# Altium schematic sheet DAQ.SchDoc
size A3
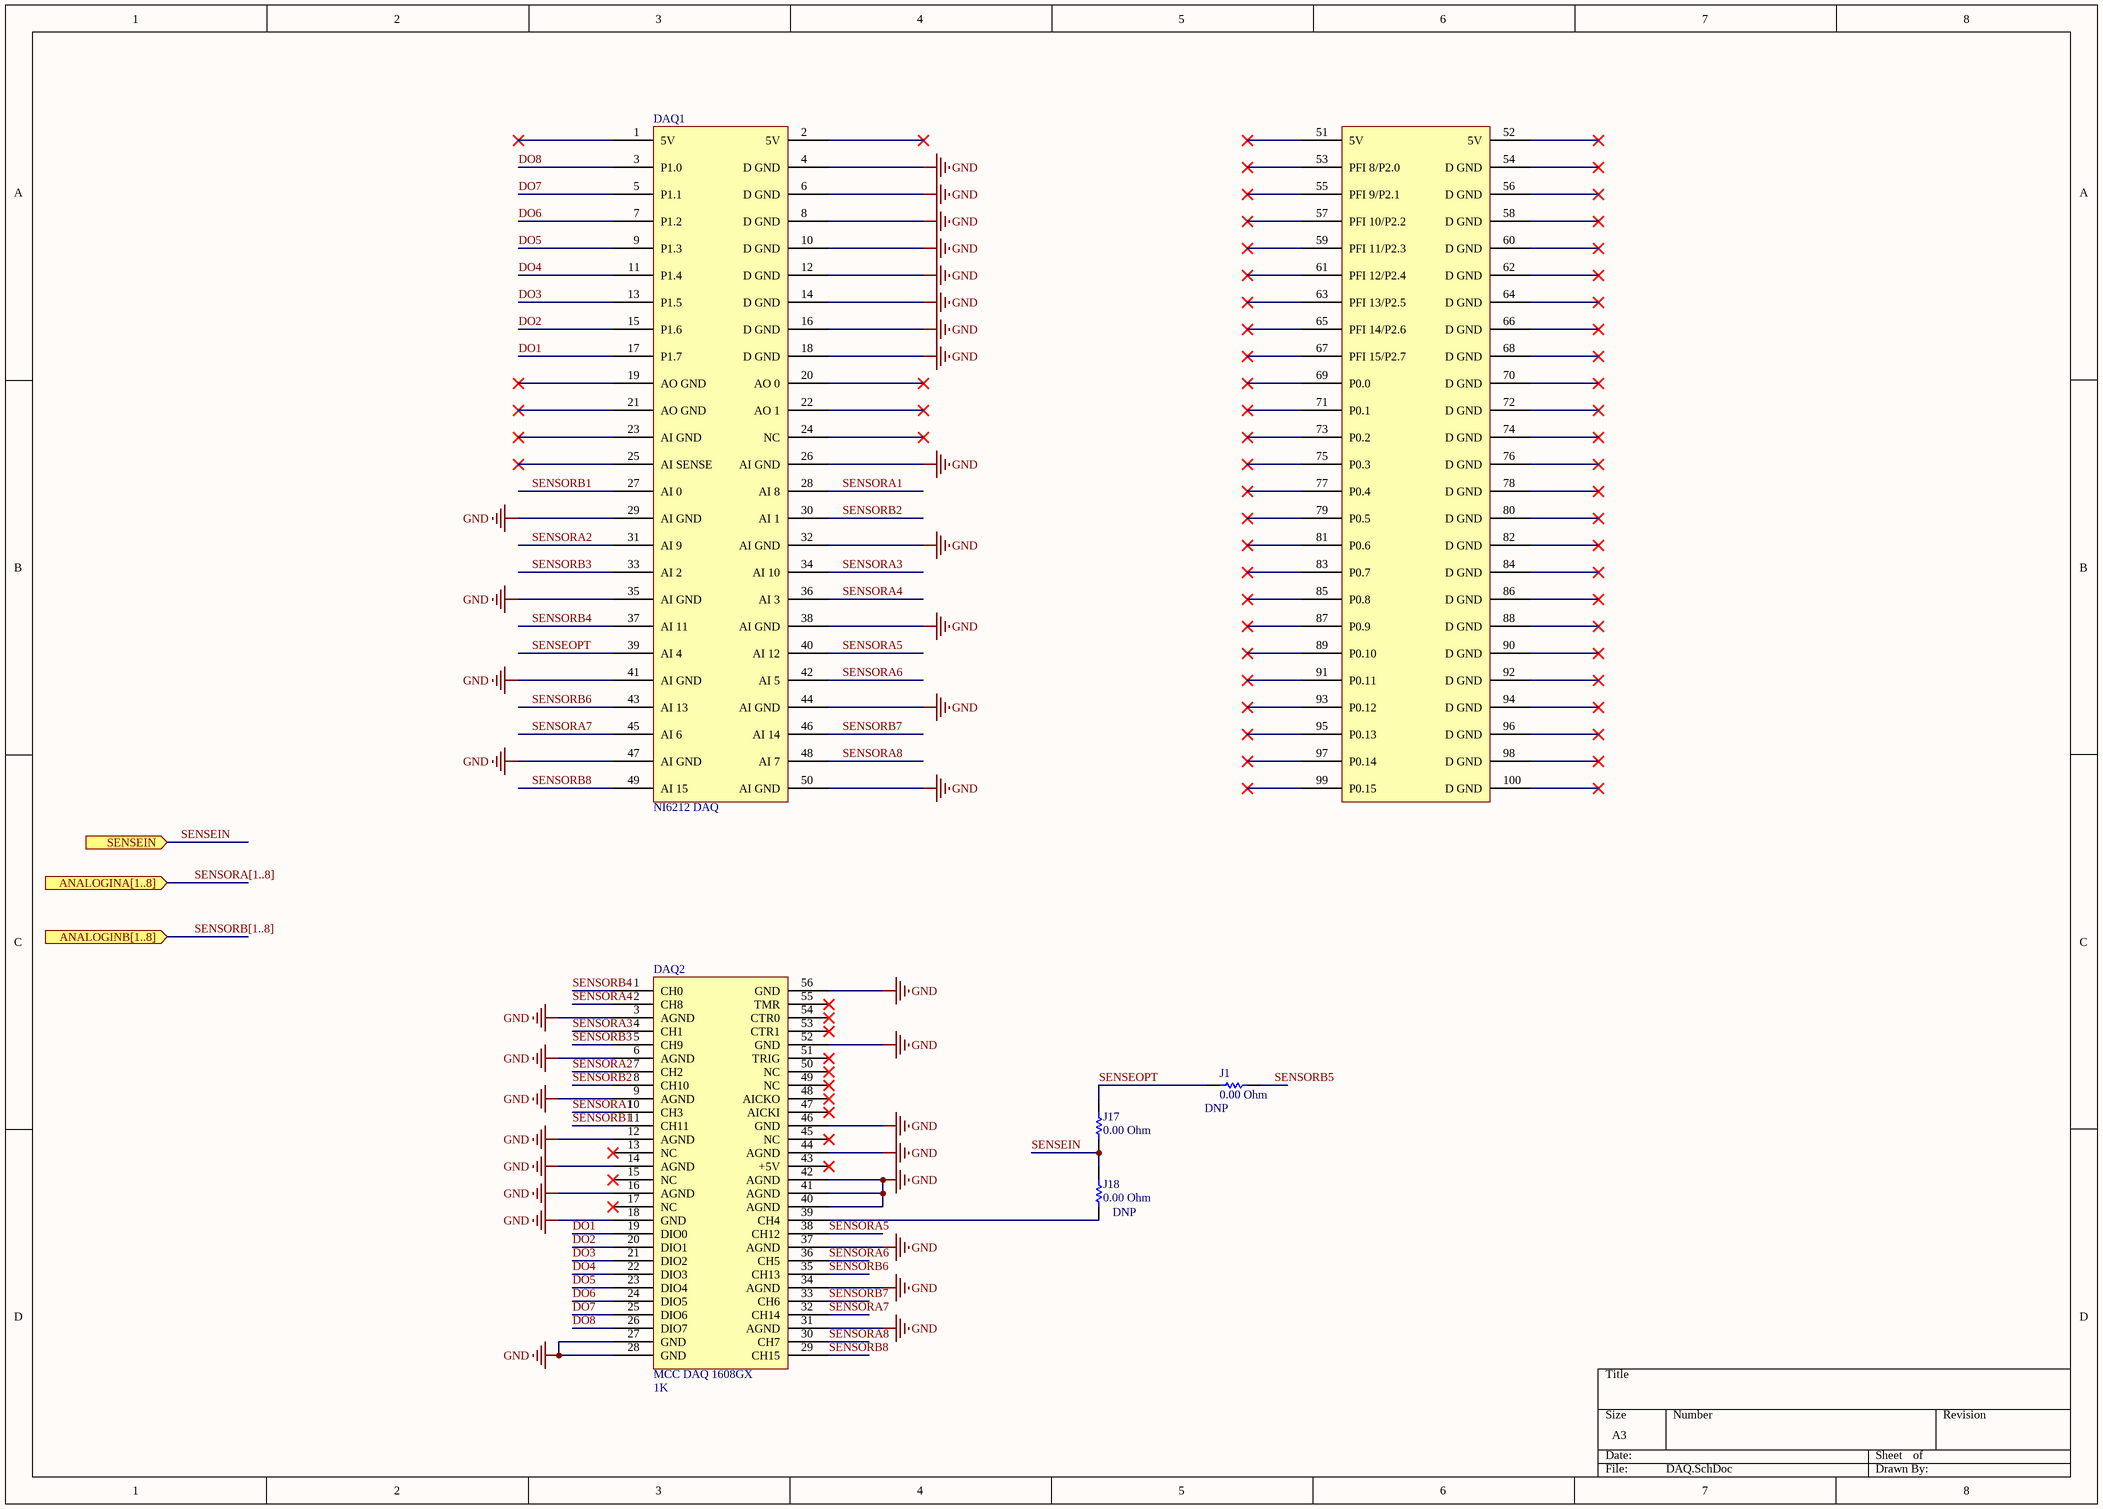
[diagram p0: DAQ.SchDoc]

## Parts
DAQ1  NI6212 DAQ  [NIDAQ6212]
DAQ2  MCC DAQ 1608GX  value 1K  [DAQ_MCC]
J1  0.00 Ohm  OPTION: DNP  [RESC1206(3216)_M]
J17  0.00 Ohm  [RESC1206(3216)_M]
J18  0.00 Ohm  OPTION: DNP  [RESC1206(3216)_M]

## Ports
ANALOGINA[1..8] (in), ANALOGINB[1..8] (in), SENSEIN (in)

## Nets
GND: DAQ1.4(D_GND) DAQ1.6(D_GND) DAQ1.8(D_GND) DAQ1.10(D_GND) DAQ1.12(D_GND) DAQ1.14(D_GND) DAQ1.16(D_GND) DAQ1.18(D_GND) DAQ1.26(AI_GND) DAQ1.29(AI_GND) DAQ1.32(AI_GND) DAQ1.35(AI_GND) DAQ1.38(AI_GND) DAQ1.41(AI_GND) DAQ1.44(AI_GND) DAQ1.47(AI_GND) DAQ1.50(AI_GND) DAQ2.3(AGND) DAQ2.6(AGND) DAQ2.9(AGND) DAQ2.12(AGND) DAQ2.14(AGND) DAQ2.16(AGND) DAQ2.18(GND) DAQ2.27(GND) DAQ2.28(GND) DAQ2.31(AGND) DAQ2.34(AGND) DAQ2.37(AGND) DAQ2.40(AGND) DAQ2.41(AGND) DAQ2.42(AGND) DAQ2.44(AGND) DAQ2.46(GND) DAQ2.52(GND) DAQ2.56(GND)
DO1: DAQ1.17(P1.7) DAQ2.19(DIO0)
DO2: DAQ1.15(P1.6) DAQ2.20(DIO1)
DO3: DAQ1.13(P1.5) DAQ2.21(DIO2)
DO4: DAQ1.11(P1.4) DAQ2.22(DIO3)
DO5: DAQ1.9(P1.3) DAQ2.23(DIO4)
DO6: DAQ1.7(P1.2) DAQ2.24(DIO5)
DO7: DAQ1.5(P1.1) DAQ2.25(DIO6)
DO8: DAQ1.3(P1.0) DAQ2.26(DIO7)
SENSEIN: J17.1 J18.2 ; port SENSEIN
SENSEOPT: DAQ1.39(AI_4) J1.2 J17.2
SENSORA1: DAQ1.28(AI_8) DAQ2.10(CH3)
SENSORA2: DAQ1.31(AI_9) DAQ2.7(CH2)
SENSORA3: DAQ1.34(AI_10) DAQ2.4(CH1)
SENSORA4: DAQ1.36(AI_3) DAQ2.2(CH8)
SENSORA5: DAQ1.40(AI_12) DAQ2.38(CH12)
SENSORA6: DAQ1.42(AI_5) DAQ2.36(CH5)
SENSORA7: DAQ1.45(AI_6) DAQ2.32(CH14)
SENSORA8: DAQ1.48(AI_7) DAQ2.30(CH7)
SENSORB1: DAQ1.27(AI_0) DAQ2.11(CH11)
SENSORB2: DAQ1.30(AI_1) DAQ2.8(CH10)
SENSORB3: DAQ1.33(AI_2) DAQ2.5(CH9)
SENSORB4: DAQ1.37(AI_11) DAQ2.1(CH0)
SENSORB5: J1.1
SENSORB6: DAQ1.43(AI_13) DAQ2.35(CH13)
SENSORB7: DAQ1.46(AI_14) DAQ2.33(CH6)
SENSORB8: DAQ1.49(AI_15) DAQ2.29(CH15)
NetDAQ2_39: DAQ2.39(CH4) J18.1

Not connected (* = marked no-connect by the designer): DAQ1 1(5V)* 2(5V)* 19(AO_GND)* 20(AO_0)* 21(AO_GND)* 22(AO_1)* 23(AI_GND)* 24(NC)* 25(AI_SENSE)* 51(5V)* 52(5V)* 53(PFI_8/P2.0)* 54(D_GND)* 55(PFI_9/P2.1)* 56(D_GND)* 57(PFI_10/P2.2)* 58(D_GND)* 59(PFI_11/P2.3)* 60(D_GND)* 61(PFI_12/P2.4)* 62(D_GND)* 63(PFI_13/P2.5)* 64(D_GND)* 65(PFI_14/P2.6)* 66(D_GND)* 67(PFI_15/P2.7)* 68(D_GND)* 69(P0.0)* 70(D_GND)* 71(P0.1)* 72(D_GND)* 73(P0.2)* 74(D_GND)* 75(P0.3)* 76(D_GND)* 77(P0.4)* 78(D_GND)* 79(P0.5)* 80(D_GND)* 81(P0.6)* 82(D_GND)* 83(P0.7)* 84(D_GND)* 85(P0.8)* 86(D_GND)* 87(P0.9)* 88(D_GND)* 89(P0.10)* 90(D_GND)* 91(P0.11)* 92(D_GND)* 93(P0.12)* 94(D_GND)* 95(P0.13)* 96(D_GND)* 97(P0.14)* 98(D_GND)* 99(P0.15)* 100(D_GND)*; DAQ2 13(NC)* 15(NC)* 17(NC)* 43(+5V)* 45(NC)* 47(AICKI)* 48(AICKO)* 49(NC)* 50(NC)* 51(TRIG)* 53(CTR1)* 54(CTR0)* 55(TMR)*

## Buses and harness runs
bus SENSORA[1..8] = port ANALOGINA[1..8]
bus SENSORB[1..8] = port ANALOGINB[1..8]

## Library data of the parts
DAQ1 = NI6212: DAQ Unit; Published: 8-Jun-2000; Publisher: National Instruments
DAQ2 = MCC USB-1608GX_OEM: Published: 8-Jun-2000; LatestRevisionDate: 29-May-2009; LatestRevisionNote: IPC-7351 Footprint Added.; PackageReference: J1-0603; Publisher: Altium Limited; PackageDescription: Chip Resistor
J1 J17 J18 = CMP-1014-00001-1: Jumper 1206 (3216 Metric); Tolerance: None; Case-EIA: 1206; Case-Metric: 3216; Technology: SMT; Power: None; Value: 0.00 Ohm; OrderURL: http://www.digikey.ie/product-detail/en/yageo/RC0603JR-070RL/311-0.0GRCT-ND/729622; Supplier 1: Digi-Key; Supplier Part Number 1: 311-0.0GRCT-ND